# EAGLE design Gravador (EAGLE 6.5.0)
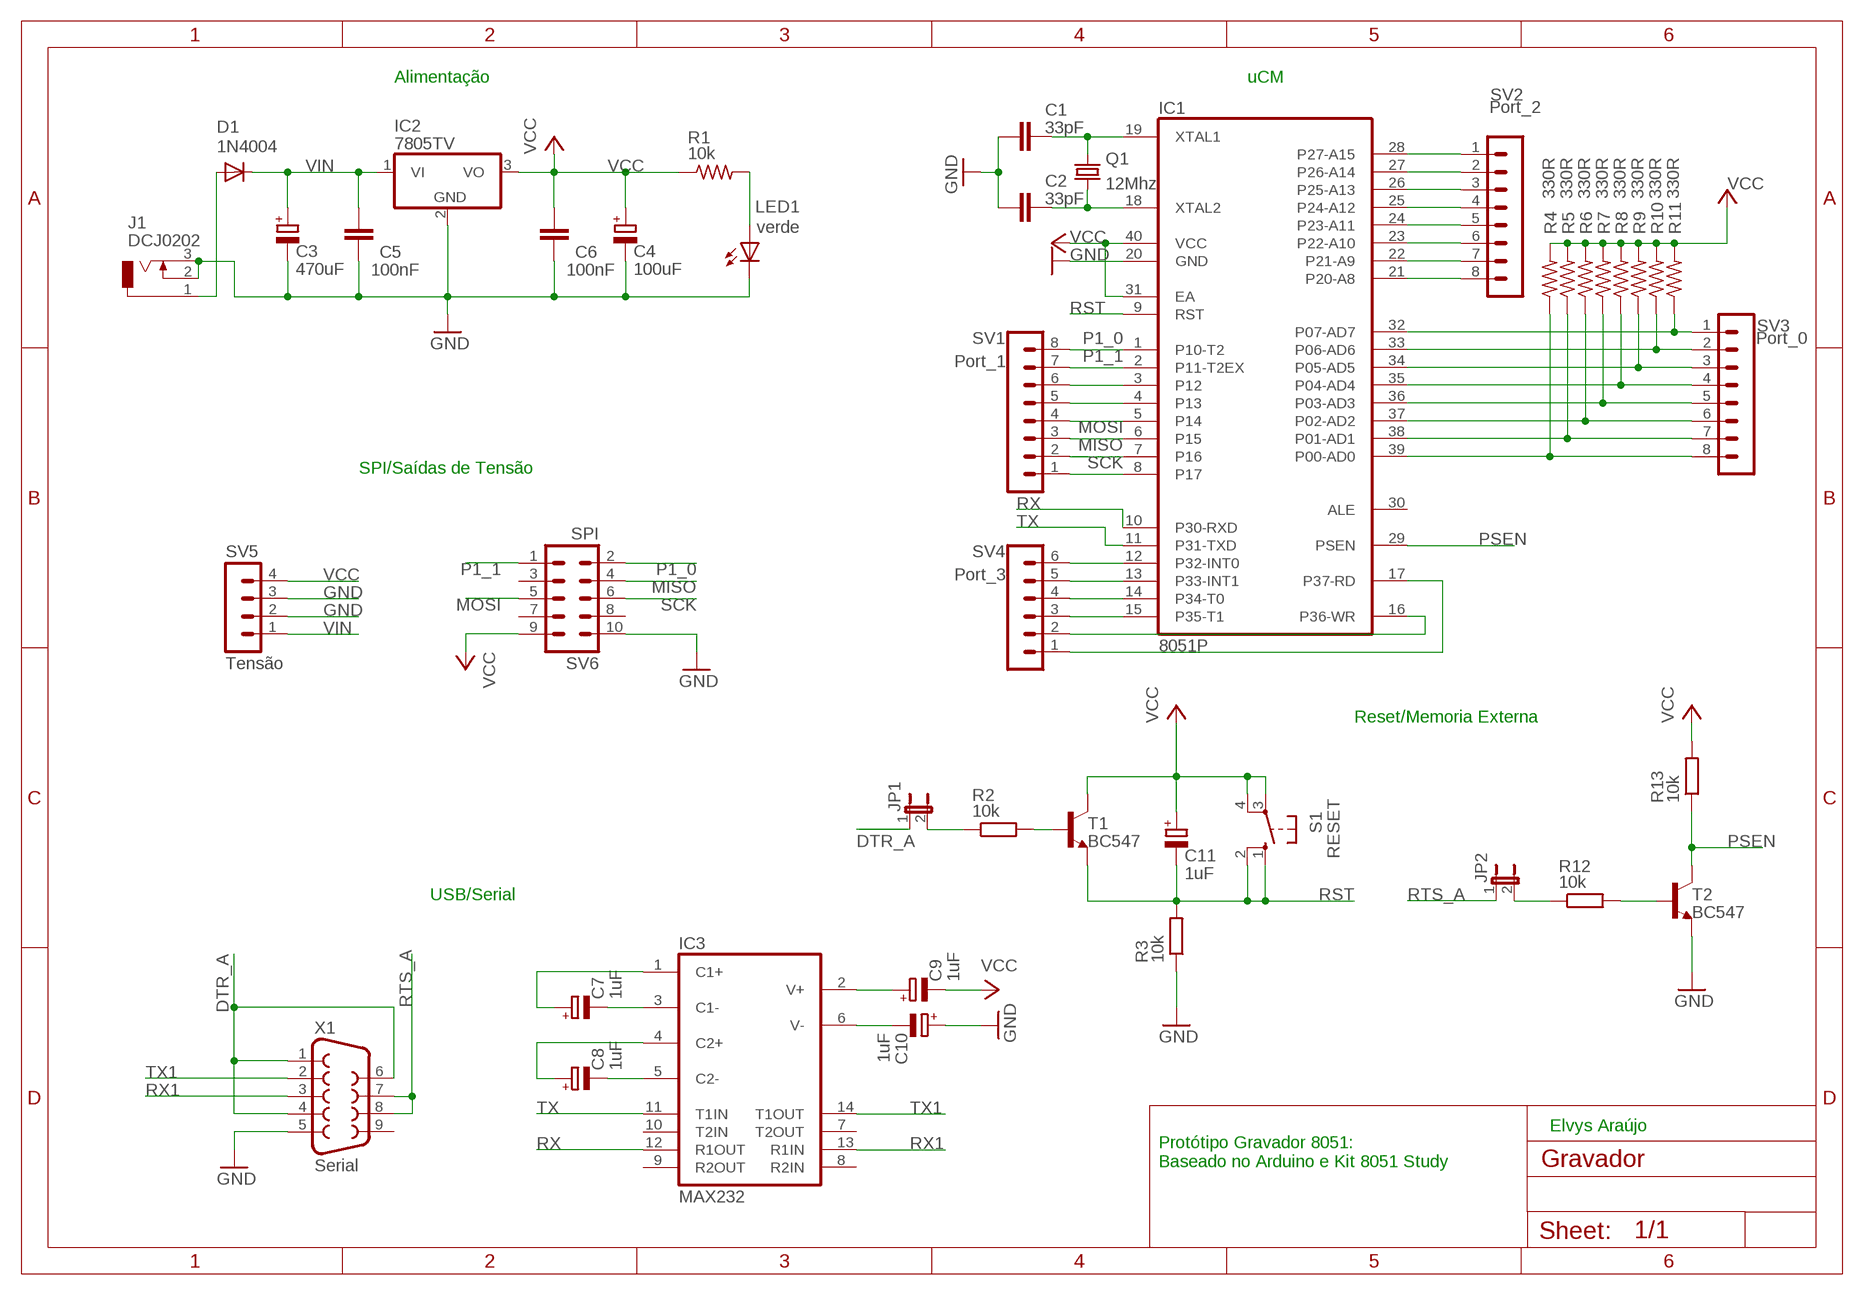
[diagram p0: schematic, sheet 1]

## Parts
C1  33pF  C5/3  [C5B3]
C2  33pF  C5/3  [C5B3]
C3  470uF  CPOL-EUE3.5-8  [E3,5-8]
C4  100uF  CPOL-EUE2,5-6E  [E2,5-6E]
C5  100nF  C5/3  [C5B3]
C6  100nF  C5/3  [C5B3]
C7  1uF  CPOL-EUE2,5-6E  [E2,5-6E]
C8  1uF  CPOL-EUE2,5-6E  [E2,5-6E]
C9  1uF  CPOL-EUE2,5-6E  [E2,5-6E]
C10  1uF  CPOL-EUE2,5-6E  [E2,5-6E]
C11  1uF  CPOL-EUE2,5-6E  [E2,5-6E]
D1  1N4004  [DO41-10]
IC1  8051P  [DIL40]
IC2  7805TV  [TO220V]
IC3  MAX232  [DIL16]
J1  DCJ0202  [DCJ0202]
JP1  JP1E  [JP1]
JP2  JP1E  [JP1]
LED1  verde  LED5MM  [LED5MM]
Q1  12Mhz  CRYSTALHC49U-V  [HC49U-V]
R1  10k  R-US_0207/2V  [0207/2V]
R2  10k  R-EU_0207/10  [0207/10@1]
R3  10k  R-EU_0207/10  [0207/10@1]
R4  330R  R-US_0207/2V  [0207/2V]
R5  330R  R-US_0207/2V  [0207/2V]
R6  330R  R-US_0207/2V  [0207/2V]
R7  330R  R-US_0207/2V  [0207/2V]
R8  330R  R-US_0207/2V  [0207/2V]
R9  330R  R-US_0207/2V  [0207/2V]
R10  330R  R-US_0207/2V  [0207/2V]
R11  330R  R-US_0207/2V  [0207/2V]
R12  10k  R-EU_0207/10  [0207/10@1]
R13  10k  R-EU_0207/10  [0207/10@1]
S1  RESET  10-XX  [B3F-10XX]
SV1  Port_1  MA08-1  [MA08-1]
SV2  Port_2  MA08-1  [MA08-1]
SV3  Port_0  MA08-1  [MA08-1]
SV4  Port_3  MA06-1  [MA06-1]
SV5  Tensão  MA04-1  [MA04-1]
SV6  SPI  MA05-2  [MA05-2]
T1  BC547  [TO92]
T2  BC547  [TO92]
X1  Serial  F09HP  [F09HP]

## Nets
DTR_A: JP1.1 X1.1 X1.4 X1.6
GND: C1.2 C2.2 C3.- C4.- C5.2 C6.2 C10.+ IC1.20(GND) IC2.2(GND) J1.2 J1.3 LED1.K(C) R3.1 SV5.2 SV5.3 SV6.10 T2.1(E) X1.5
MISO: IC1.7(P16) SV1.2 SV6.4
MOSI: IC1.6(P15) SV1.3 SV6.5
N$1: C1.1 IC1.19(XTAL1) Q1.1
N$2: C2.1 IC1.18(XTAL2) Q1.2
N$3: IC1.15(P35-T1) SV4.3
N$4: IC1.14(P34-T0) SV4.4
N$8: IC1.5(P14) SV1.4
N$9: IC1.4(P13) SV1.5
N$10: IC1.3(P12) SV1.6
N$13: IC1.28(P27-A15) SV2.1
N$14: IC1.27(P26-A14) SV2.2
N$15: IC1.26(P25-A13) SV2.3
N$16: IC1.25(P24-A12) SV2.4
N$17: IC1.24(P23-A11) SV2.5
N$18: IC1.23(P22-A10) SV2.6
N$19: IC1.22(P21-A9) SV2.7
N$20: IC1.21(P20-A8) SV2.8
N$21: IC1.13(P33-INT1) SV4.5
N$22: IC1.32(P07-AD7) R11.1 SV3.1
N$23: IC1.33(P06-AD6) R10.1 SV3.2
N$24: IC1.34(P05-AD5) R9.1 SV3.3
N$25: IC1.35(P04-AD4) R8.1 SV3.4
N$26: IC1.36(P03-AD3) R7.1 SV3.5
N$27: IC1.37(P02-AD2) R6.1 SV3.6
N$28: IC1.38(P01-AD1) R5.1 SV3.7
N$29: IC1.12(P32-INT0) SV4.6
N$31: IC1.16(P36-WR) SV4.2
N$32: IC1.17(P37-RD) SV4.1
N$33: LED1.A R1.2
N$34: C7.+ IC3.1(C1+)
N$35: D1.A J1.1
N$37: C7.- IC3.3(C1-)
N$38: C8.+ IC3.4(C2+)
N$39: C8.- IC3.5(C2-)
N$40: C9.+ IC3.2(V+)
N$41: C10.- IC3.6(V-)
N$42: JP1.2 R2.1
N$43: R2.2 T1.2(B)
N$44: IC1.39(P00-AD0) R4.1 SV3.8
N$47: JP2.2 R12.1
N$48: R12.2 T2.2(B)
P1_0: IC1.1(P10-T2) SV1.8 SV6.2
P1_1: IC1.2(P11-T2EX) SV1.7 SV6.1
PSEN: IC1.29(PSEN) R13.1 T2.3(C)
RST: C11.- IC1.9(RST) R3.2 S1.1(S) S1.2(S1) T1.1(E)
RTS_A: JP2.1 X1.7 X1.8
RX: IC1.10(P30-RXD) IC3.12(R1OUT)
RX1: IC3.13(R1IN) X1.3
SCK: IC1.8(P17) SV1.1 SV6.6
TX: IC1.11(P31-TXD) IC3.11(T1IN)
TX1: IC3.14(T1OUT) X1.2
VCC: C4.+ C6.1 C9.- C11.+ IC1.31(EA) IC1.40(VCC) IC2.3(VO) R1.1 R4.2 R5.2 R6.2 R7.2 R8.2 R9.2 R10.2 R11.2 R13.2 S1.3(P) S1.4(P1) SV5.4 SV6.9 T1.3(C)
VIN: C3.+ C5.1 D1.C IC2.1(VI) SV5.1
Unconnected: IC1.30(ALE) IC3.7(T2OUT) IC3.8(R2IN) IC3.9(R2OUT) IC3.10(T2IN) SV6.3 SV6.7 SV6.8 X1.9

## Notes on the sheet
- Alimentação | uCM
- SPI/Saídas de Tensão
- Reset/Memoria Externa
- USB/Serial
- Elvys Araújo
- Protótipo Gravador 8051:
  Baseado no Arduino e Kit 8051 Study

## Power pins joined to a net without a drawn wire
GND: IC3.15(GND)
VCC: IC3.16(VCC)

## Library data of the parts
C1 C2 C5 C6 = capacitor-wima:C: CAPACITOR naming: grid - package width
C3 C4 C7-C11 = rcl:CPOL-EU: POLARIZED CAPACITOR, European symbol
D1 = diode:1N4004: DIODE general purpose rectifier, 1 A
IC1 = micro-intel:8051: (CHMOS) SINGLE-CHIP 8-BIT MICROCONTROLLER 80C31BH / 80C51 BH / 87C51 MCS 51 Source: http://apps.intel.com .. 27041907.pdf; OC_FARNELL: unknown; OC_NEWARK: unknown
IC2 = linear:78*: Positive VOLTAGE REGULATOR Source: http://cache.national.com/ds/LM/LM78L05.pdf http://www.fairchildsemi.com/ds/LM/LM7805.pdf
IC3 = maxim:MAX232: RS232 TRANSCEIVER; MF: MAXIM; MPN: MAX232ACPE+; OC_FARNELL: 9723773; OC_NEWARK: 68K4544
J1 = con-jack:DCJ0202: DC POWER JACK Source: DCJ0202.pdf; OC_FARNELL: unknown; OC_NEWARK: unknown
JP1 JP2 = jumper:JP1E: JUMPER
LED1 = led:LED: LED OSRAM: - CHIPLED LG R971, LG N971, LY N971, LG Q971, LY Q971, LO R971, LY R971 LH N974, LH R974 LS Q976, LO Q976, LY Q976 LO Q996 - Hyper CHIPLED LW Q18S LB Q993, LB Q99A, LB R99A - SideLED LS A670, LO A670, LY A670, LG A670, LP A670 LB A673, LV A673, LT A673, LW A673 LH A674 LY A675 LS A676, LA A676, LO A676, LY A676, LW A676 LS A679, LY A679, LG A679 - Hyper Micro SIDELED® LS Y876, LA Y876, LO Y876, LY Y876 LT Y87S - SmartLED LW L88C, LW L88S LB L89C, LB L89S, LG L890 LS L89K, LO L89K, LY L89K LS L896, LA L896, LO L896, LY L896 - TOPLED LS T670, LO T670, LY T670, LG T670, LP T670 LSG T670, LSP T670, LSY T670, LOP T670, LYG T670 LG T671, LOG T671, LSG T671 LB T673, LV T673, LT T673, LW T673 LH T674 LS T676, LA T676, LO T676, LY T676, LB T676, LH T676, LSB T676, LW T676 LB T67C, LV T67C, LT T67C, LS T67K, LO T67K, LY T67K, LW E67C LS E67B, LA E67B, LO E67B, LY E67B, LB E67C, LV E67C, LT E67C LW T67C LS T679, LY T679, LG T679 LS T770, LO T770, LY T770, LG T770, LP T770 LB T773, LV T773, LT T773, LW T773 LH T774 LS E675, LA E675, LY E675, LS T675 LS T776, LA T776, LO T776, LY T776, LB T776 LHGB T686 LT T68C, LB T68C - Hyper Mini TOPLED® LB M676 - Mini TOPLED Santana® LG M470 LS M47K, LO M47K, LY M47K Source: http://www.osram.convergy.de LUXEON: - LUMILED® LXK2-PW12-R00, LXK2-PW12-S00, LXK2-PW14-U00, LXK2-PW14-V00 LXK2-PM12-R00, LXK2-PM12-S00, LXK2-PM14-U00 LXK2-PE12-Q00, LXK2-PE12-R00, LXK2-PE12-S00, LXK2-PE14-T00, LXK2-PE14-U00 LXK2-PB12-K00, LXK2-PB12-L00, LXK2-PB12-M00, LXK2-PB14-N00, LXK2-PB14-P00, LXK2-PB14-Q00 LXK2-PR12-L00, LXK2-PR12-M00, LXK2-PR14-Q00, LXK2-PR14-R00 LXK2-PD12-Q00, LXK2-PD12-R00, LXK2-PD12-S00 LXK2-PH12-R00, LXK2-PH12-S00 LXK2-PL12-P00, LXK2-PL12-Q00, LXK2-PL12-R00 Source: www.luxeon.com KINGBRIGHT: KA-3528ASYC Source: www.kingbright.com
Q1 = crystal:CRYSTAL: CRYSTAL; OC_FARNELL: 1666969; OC_NEWARK: unknown
R1 R4-R11 = rcl:R-US_: RESISTOR, American symbol
R2 R3 R12 R13 = rcl:R-EU_: RESISTOR, European symbol
S1 = switch-omron:10-XX: OMRON SWITCH; MPN: B3F-1000; OC_FARNELL: 176432; OC_NEWARK: 36M3542
SV1-SV3 = con-lstb:MA08-1: PIN HEADER; OC_FARNELL: unknown; OC_NEWARK: unknown
SV4 = con-lstb:MA06-1: PIN HEADER; OC_FARNELL: unknown; OC_NEWARK: unknown
SV5 = con-lstb:MA04-1: PIN HEADER; OC_FARNELL: unknown; OC_NEWARK: unknown
SV6 = con-lstb:MA05-2: PIN HEADER; OC_FARNELL: unknown; OC_NEWARK: unknown
T1 T2 = transistor:BC547: NPN TRANSISTOR
X1 = con-subd:F09: SUB-D; OC_FARNELL: unknown; OC_NEWARK: unknown

## Board
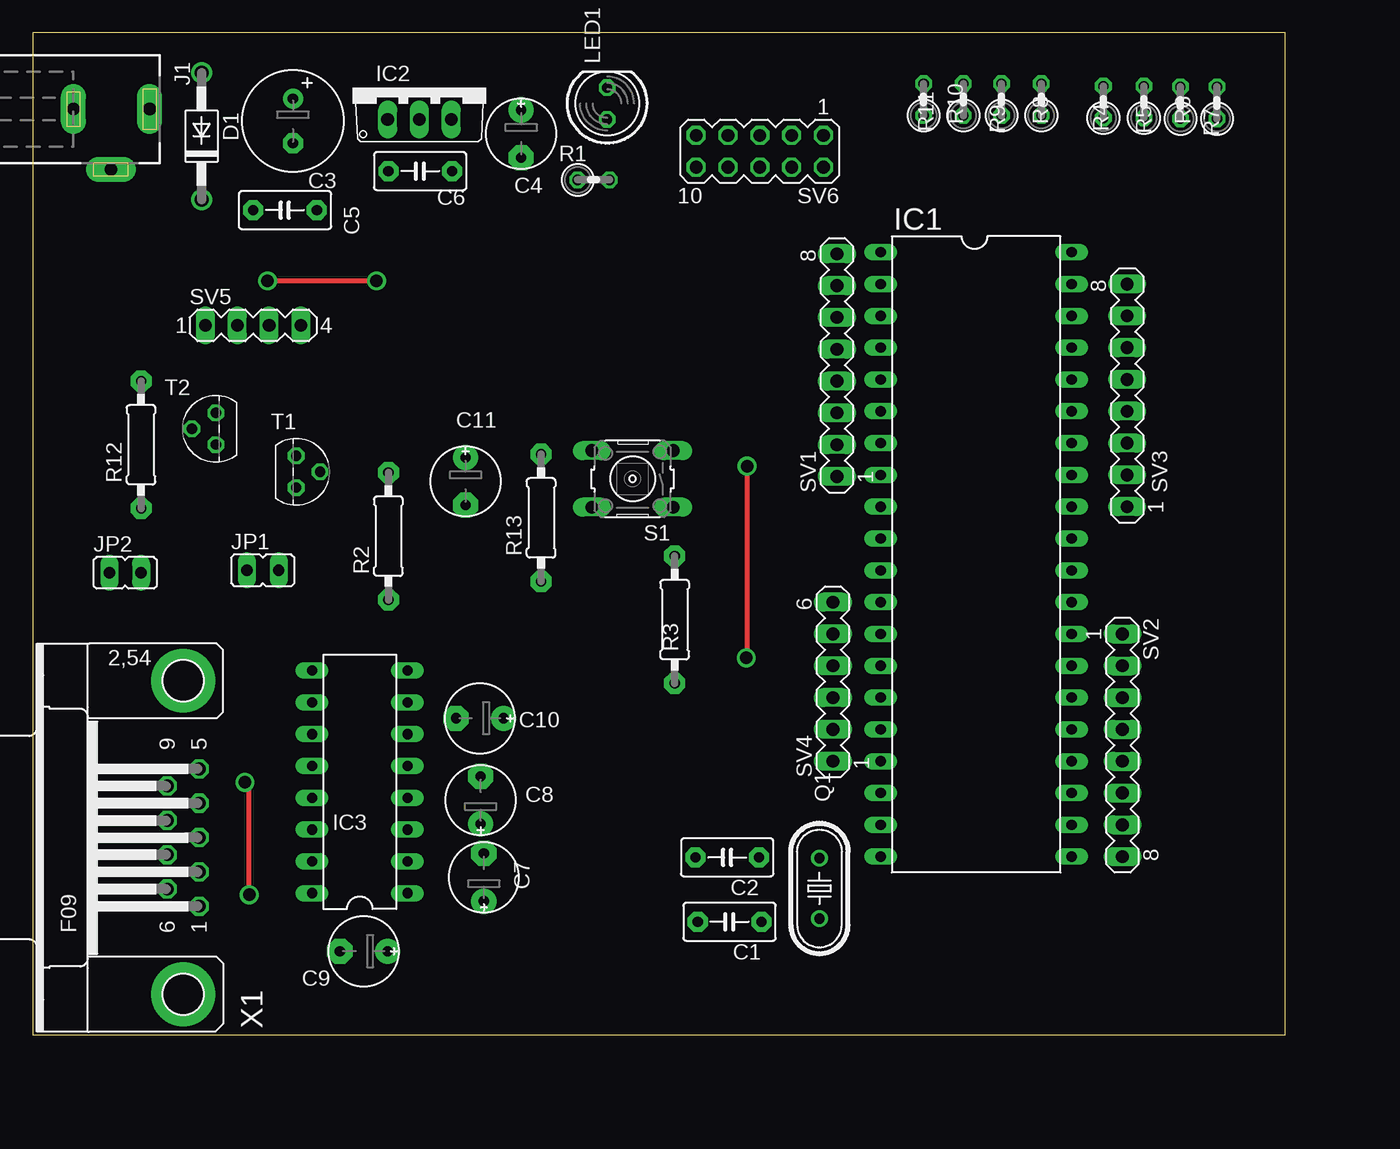
[diagram p1: board, top side]
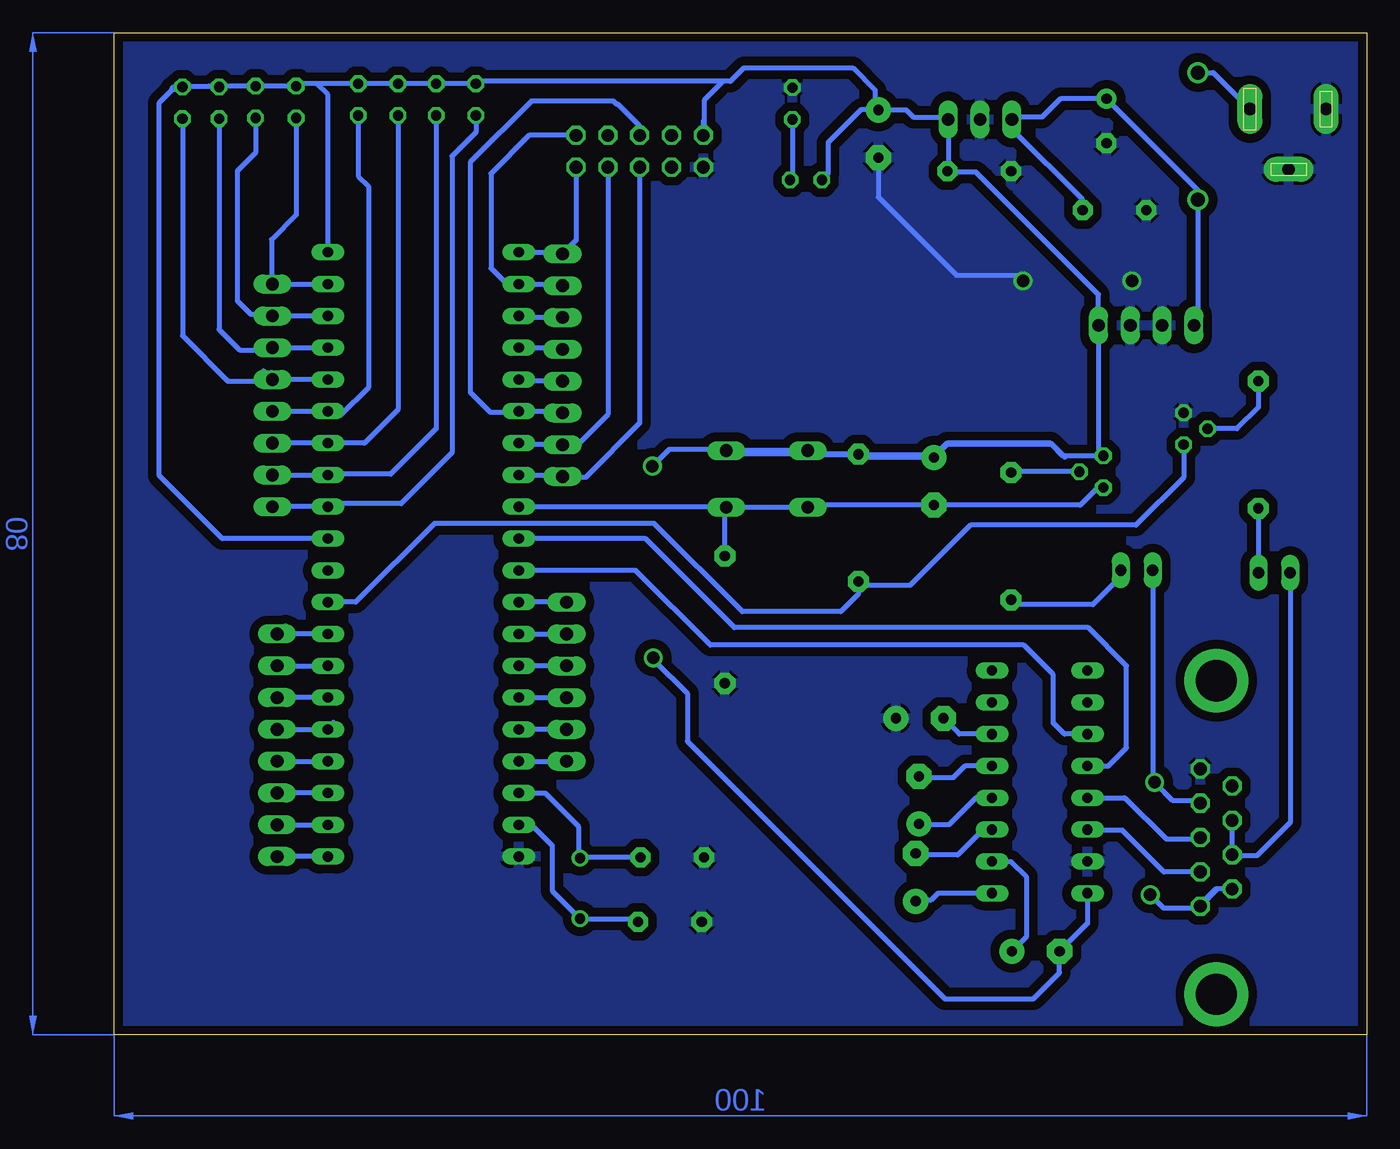
[diagram p2: board, bottom side, seen from below]

Size 100 x 80 mm. Coordinates in mm from the lower left corner, seen from the top.
Outline: 0,0 100,0 100,80 0,80 0,0
Copper layers (1*16): Top 0.035mm / dielectric 1.5mm / Bottom 0.035mm
Design rules "default *": minimum track width 10mil, minimum drill 24mil, track to track 12mil, track to pad 12mil, pad to pad 12mil, via to via 12mil, smd to smd 12mil, copper to edge 10mil, drill to drill 8mil, minimum pad ring 10mil, minimum via ring 8mil, stop-mask expansion 4mil, vias tented up to drill 0mil, thermal gap 10mil

### Footprints (pad centres in the part's own frame; a part is rotated, then mirrored left to right if it is on the bottom)
C5B3 = drill 0.813 pad 1.6 octagon: 1 -2.54,0; 2 2.54,0
E3,5-8 = drill 0.813 pad 1.6: + -1.778,0 | drill 0.813 pad 1.6 octagon: - 1.778,0
E2,5-6E = drill 0.813 pad 2: + -1.905,0 | drill 0.813 pad 2 octagon: - 1.905,0
DO41-10 = drill 1.118: A 5.08,0; C -5.08,0
DIL40 = drill 0.813 long: 1 -24.13,-7.62; 2 -21.59,-7.62; 3 -19.05,-7.62; 4 -16.51,-7.62; 5 -13.97,-7.62; 6 -11.43,-7.62; 7 -8.89,-7.62; 8 -6.35,-7.62; 9 -3.81,-7.62; 10 -1.27,-7.62; 11 1.27,-7.62; 12 3.81,-7.62; 13 6.35,-7.62; 14 8.89,-7.62; 15 11.43,-7.62; 16 13.97,-7.62; 17 16.51,-7.62; 18 19.05,-7.62; 19 21.59,-7.62; 20 24.13,-7.62; 21 24.13,7.62; 22 21.59,7.62; 23 19.05,7.62; 24 16.51,7.62; 25 13.97,7.62; 26 11.43,7.62; 27 8.89,7.62; 28 6.35,7.62; 29 3.81,7.62; 30 1.27,7.62; 31 -1.27,7.62; 32 -3.81,7.62; 33 -6.35,7.62; 34 -8.89,7.62; 35 -11.43,7.62; 36 -13.97,7.62; 37 -16.51,7.62; 38 -19.05,7.62; 39 -21.59,7.62; 40 -24.13,7.62
TO220V = drill 1.016 long: 1 -2.54,-2.54; 2 0,-2.54; 3 2.54,-2.54
DIL16 = drill 0.813 long: 1 -8.89,-3.81; 2 -6.35,-3.81; 3 -3.81,-3.81; 4 -1.27,-3.81; 5 1.27,-3.81; 6 3.81,-3.81; 7 6.35,-3.81; 8 8.89,-3.81; 9 8.89,3.81; 10 6.35,3.81; 11 3.81,3.81; 12 1.27,3.81; 13 -1.27,3.81; 14 -3.81,3.81; 15 -6.35,3.81; 16 -8.89,3.81
DCJ0202 = drill 1 pad 2 long: 1 0,3.1; 2 4.8,0; 3 0,-3
JP1 = drill 0.914 long: 1 0,-1.27; 2 0,1.27
LED5MM = drill 0.813 octagon: A -1.27,0; K 1.27,0
HC49U-V = drill 0.813: 1 -2.413,0; 2 2.413,0
0207/2V = drill 0.813 octagon: 1 -1.27,0; 2 1.27,0
0207/10@1 = drill 0.813 pad 1.676 octagon: 1 -5.08,0; 2 5.08,0
B3F-10XX = drill 1.016 long: 1 -3.251,2.261; 2 3.251,2.261; 3 -3.251,-2.261; 4 3.251,-2.261
MA08-1 = drill 1.016 long: 1 -8.89,0; 2 -6.35,0; 3 -3.81,0; 4 -1.27,0; 5 1.27,0; 6 3.81,0; 7 6.35,0; 8 8.89,0
MA06-1 = drill 1.016 long: 1 -6.35,0; 2 -3.81,0; 3 -1.27,0; 4 1.27,0; 5 3.81,0; 6 6.35,0
MA04-1 = drill 1.016 long: 1 -3.81,0; 2 -1.27,0; 3 1.27,0; 4 3.81,0
MA05-2 = drill 1.016 octagon: 1 -5.08,-1.27; 2 -5.08,1.27; 3 -2.54,-1.27; 4 -2.54,1.27; 5 0,-1.27; 6 0,1.27; 7 2.54,-1.27; 8 2.54,1.27; 9 5.08,-1.27; 10 5.08,1.27
TO92 = drill 0.813 octagon: 1 1.27,0; 2 0,1.905; 3 -1.27,0
F09HP = drill 1.016 octagon: 1 -5.486,-1.27; 2 -2.743,-1.27; 3 0,-1.27; 4 2.743,-1.27; 5 5.486,-1.27; 6 -4.115,1.27; 7 -1.372,1.27; 8 1.372,1.27; 9 4.115,1.27 | drill 3.302 pad 5.08: G1 -12.522,0; G2 12.522,0

### Placement (x,y rotation side)
C1  55.63,9.02 180 top
C2  55.44,14.16 180 top
C3  20.76,72.96 270 top
C4  38.99,71.95 270 top
C5  20.13,65.85 180 top
C6  30.92,68.96 180 top
C7  36,12.57 90 top
C8  35.75,18.73 90 top
C9  26.42,6.67 180 top
C10  35.69,25.27 180 top
C11  34.54,44.2 270 top
D1  13.46,71.75 90 top
IC1  75.31,38.35 270 top
IC2  30.86,75.63 0 top
IC3  26.1,20.19 90 top
J1  6.22,73.91 270 top
JP1  18.35,37.08 270 top
JP2  7.37,36.89 270 top
LED1  45.85,74.36 90 top
Q1  62.8,11.68 90 top
R1  44.77,68.26 0 top
R2  28.38,39.81 90 top
R3  51.24,33.15 90 top
R4  85.47,74.49 90 top
R5  88.71,74.49 90 top
R6  91.63,74.42 90 top
R7  94.55,74.42 90 top
R8  80.52,74.68 90 top
R9  77.34,74.68 90 top
R10  74.3,74.68 90 top
R11  71.12,74.68 90 top
R12  8.64,47.12 90 top
R13  40.58,41.27 90 top
S1  47.88,44.39 180 top
SV1  64.2,53.47 90 top
SV2  87,23.11 270 top
SV3  87.38,51.05 90 top
SV4  63.88,28.19 90 top
SV5  17.59,56.64 0 top
SV6  58.04,70.55 180 top
T1  21.02,44.96 270 top
T2  14.61,48.39 90 top
X1  12,15.75 90 top

### Tracks (layer width: path | path; a pad name or v marks a point on that pad's centre or on a via)
DTR_A  (via drill 1)
  Top 0.406: v17.27,11.18 17.27,19.88 16.95,20.19 | 16.95,20.19 16.99,20.23 | 16.95,20.19 v16.92,20.16
  Bottom 0.406: JP1.1 17.08,20.32 v16.92,20.16 16.13,19.37 15.49,18.73 13.51,18.73 X1.4 | X1.1 11.9,11.63 X1.6 12.05,11.63 13.59,10.1 | 13.59,10.1 13.53,10.1 | v17.27,11.18 16.19,10.1 13.59,10.1
GND  (via drill 1)
  Top 0.406: v27.43,60.2 v18.73,60.2
  Bottom 0.406: C4.- 38.99,66.86 32.77,60.64 27.88,60.64 v27.43,60.2
  pour Bottom (isolate 0.7): -0.06,0.06 100.46,0.06 100.46,80.14 -0.06,80.14
MISO
  Bottom 0.406: SV6.4 60.58,49.53 63.25,46.86 63.94,46.86 SV1.2 68.14,47.12 68.64,47.62 68.07,47.62 IC1.7
MOSI
  Bottom 0.406: SV6.5 58.04,72.58 59.75,74.3 59.88,74.3 60.13,74.55 66.67,74.55 71.56,69.66 71.56,51.31 69.98,49.72 67.75,49.72 IC1.6 64.33,49.78 SV1.3
N$1
  Bottom 0.406: IC1.19 66.67,16.76 65.02,15.11 65.02,11.49 Q1.1 58.42,9.27 C1.1
N$2
  Bottom 0.406: IC1.18 65.6,19.3 62.93,16.64 62.93,14.22 Q1.2 62.74,14.16 C2.1
N$3
  Bottom 0.406: IC1.15 SV4.3
N$4
  Bottom 0.406: SV4.4 IC1.14
N$8
  Bottom 0.406: SV1.4 67.06,52.2 67.18,52.32 IC1.5
N$9
  Bottom 0.406: IC1.4 64.33,54.86 SV1.5
N$10
  Bottom 0.406: SV1.6 67.56,57.28 IC1.3
N$13
  Bottom 0.406: IC1.28 85.66,32 86.3,32.64 86.36,32.64 SV2.1
N$14
  Bottom 0.406: SV2.2 83.5,29.46 83.44,29.53 83,29.53 IC1.27
N$15
  Bottom 0.406: IC1.26 SV2.3
N$16
  Bottom 0.406: SV2.4 83.06,24.38 82.55,24.89 | 82.49,24.96 82.55,24.89 | 82.55,24.89 82.55,24.77 IC1.25
N$17
  Bottom 0.406: SV2.5 IC1.24
N$18
  Bottom 0.406: IC1.23 SV2.6
N$19
  Bottom 0.406: SV2.7 IC1.22
N$20
  Bottom 0.406: IC1.21 SV2.8
N$21
  Bottom 0.406: IC1.13 SV4.5
N$22
  Bottom 0.406: R11.1 71.12,72.07 73.03,70.17 73.03,46.48 77.09,42.42 82.68,42.42 IC1.32 SV3.1
N$23
  Bottom 0.406: R10.1 74.3,48.39 77.92,44.77 82.87,44.77 IC1.33 83.31,45.09 83.31,45.15 83.76,44.7 SV3.2
N$24
  Bottom 0.406: R9.1 77.34,49.91 80.01,47.24 IC1.34 SV3.3
N$25
  Bottom 0.406: R8.1 80.52,68.58 79.69,67.75 79.69,51.69 81.92,49.47 82.61,49.47 IC1.35 SV3.4
N$26
  Bottom 0.406: R7.1 94.55,55.82 90.93,52.2 88.14,52.2 87.44,52.9 87.44,52.26 87.06,51.88 87.06,52.01 SV3.5 | 88.08,53.02 88.01,52.96 SV3.5 | IC1.36 SV3.5
N$27
  Bottom 0.406: R6.1 91.63,56.33 89.98,54.67 87.57,54.67 SV3.6 IC1.37
N$28
  Bottom 0.406: R5.1 88.71,70.42 90.17,68.96 90.17,58.61 89.09,57.53 87.5,57.53 SV3.7 IC1.38
N$29
  Bottom 0.406: SV4.6 IC1.12
N$31
  Bottom 0.406: SV4.2 IC1.16
N$32
  Bottom 0.406: IC1.17 SV4.1 | SV4.1 63.5,21.84 63.31,22.04 63.69,22.04 SV4.1
N$33
  Bottom 0.406: LED1.A 45.85,68.45 R1.2
N$34
  Bottom 0.406: IC3.1 34.23,11.3 34.8,10.73 35.94,10.73 C7.+
N$35
  Bottom 0.406: D1.A 12.24,76.83 J1.1
N$37
  Bottom 0.406: IC3.3 30.61,16.38 32.64,14.35 35.88,14.35 C7.-
N$38
  Bottom 0.406: IC3.4 31.18,18.92 33.34,16.76 35.69,16.76 C8.+
N$39
  Bottom 0.406: IC3.5 32.07,21.46 33.02,20.51 35.62,20.51 C8.-
N$40
  Bottom 0.406: IC3.2 28.38,13.84 27.18,12.64 27.18,7.81 C9.+
N$41
  Bottom 0.406: IC3.6 32.51,24 C10.-
N$42
  Bottom 0.406: JP1.2 19.62,36.58 21.84,34.35 28,34.35 R2.1
N$43
  Bottom 0.406: T1.2 27.69,44.96 27.75,44.9 R2.2
N$44
  Bottom 0.406: R4.1 85.47,65.47 87.44,63.5 87.44,60.01 SV3.8 83.69,59.94 83.44,59.69 82.74,59.69 82.23,60.2 82.68,60.2 IC1.39
N$47
  Bottom 0.406: R12.1 JP2.2
N$48
  Bottom 0.406: R12.2 8.64,50.1 10.35,48.39 T2.2
P1_0
  Bottom 0.406: SV6.2 63.12,63.44 SV1.8 64.2,62.48 IC1.1
P1_1
  Bottom 0.406: SV6.1 66.86,71.82 69.91,68.77 69.91,61.21 68.71,60.01 67.75,60.01 IC1.2 64.33,59.94 SV1.7
PSEN
  Bottom 0.406: T2.3 14.61,44.51 18.41,40.7 31.62,40.7 36.45,35.88 40.26,35.88 R13.1 40.58,35.18 41.97,33.78 49.85,33.78 56.9,40.83 74.42,40.83 80.71,34.54 IC1.29
RST
  Bottom 0.406: T1.1 21.46,43.69 22.86,42.29 C11.- 44.46,42.29 S1.2 S1.1 51.24,42.01 51.24,41.59 | R3.2 51.24,41.59 | IC1.9 51.82,42.16 51.24,41.59
RTS_A
  Bottom 0.406: JP2.1 6.1,16.95 8.76,14.29 10.64,14.29 X1.7 X1.8
RX
  Bottom 0.406: IC3.12 20.64,21.46 19.18,22.92 19.18,29.46 22.23,32.51 50.48,32.51 57.59,39.62 IC1.10
RX1
  Bottom 0.406: IC3.13 19.3,18.92 16,15.62 13.4,15.62 X1.3
SCK
  Bottom 0.406: SV6.6 58.04,48.83 62.36,44.51 64.14,44.51 SV1.1 64.33,44.7 IC1.8
TX
  Bottom 0.406: IC3.11 24.13,24 25.02,24.89 25.02,28.77 27.37,31.11 52.39,31.11 58.36,37.08 IC1.11
TX1
  Bottom 0.406: X1.2 16.18,13.01 19.49,16.32 22.23,16.32 IC3.14
VCC  (via drill 1)
  Top 0.406: v57.02,45.4 57.02,30.16 v56.96,30.1
  Bottom 0.406: C4.+ 40.39,73.85 42.99,71.25 42.99,68.77 R1.1 | 83.82,75.95 R8.2 R9.2 R10.2 R11.2 70.93,76.14 51.37,76.14 | 83.82,75.95 85.28,75.95 R4.2 R5.2 91.69,75.75 | 92.46,75.75 91.69,75.75 | 91.69,75.75 R6.2 R7.2 | R7.2 95.12,75.69 | 95.12,75.69 95.25,75.69 95.44,75.5 94.74,75.5 R7.2 | IC1.40 82.93,75.06 83.82,75.95 | IC1.31 91.38,39.62 96.39,44.64 96.39,74.42 95.12,75.69 | C4.+ 36.77,73.85 36.2,73.28 33.59,73.28 IC2.3 33.4,69.03 C6.1 33.4,68.9 31.18,68.9 21.4,59.12 SV5.4 21.4,46.61 T1.3 | SV6.9 52.96,72.45 | 52.96,72.45 52.96,72.96 | C4.+ 39.24,74.11 39.24,75.44 41.02,77.22 49.72,77.22 50.8,76.14 51.37,76.14 | 51.37,76.14 52.9,74.61 52.9,72.52 52.96,72.45 | T1.3 24.26,46.23 25.15,47.12 33.53,47.12 C11.+ 40.32,46.1 R13.2 44.34,46.35 S1.4 S1.3 | T1.3 21.02,46.29 21.08,46.35 | IC3.16 22.29,8.89 C9.- 24.57,6.6 24.57,5.91 24.51,5.84 24.51,4.95 26.61,2.86 33.66,2.86 54.23,23.43 54.23,27.24 56.96,29.97 v56.96,30.1 | T1.3 24,46.23 24.13,46.1 24.13,46.16 25.21,47.24 33.53,47.24 34.48,46.29 44.32,46.29 44.58,46.55 44.58,46.48 44.45,46.35 51.18,46.35 51.56,46.74 55.69,46.74 v57.02,45.4
VIN
  Bottom 0.406: C5.1 22.67,66.67 28.32,72.33 IC2.1 28.13,73.28 25.91,73.28 24.45,74.74 C3.+ 13.46,67.44 D1.C 13.46,56.96 SV5.1
(copper drawn outside any net)
  shapes: Bottom area x2